# EAGLE design VU (EAGLE 8.1.1)
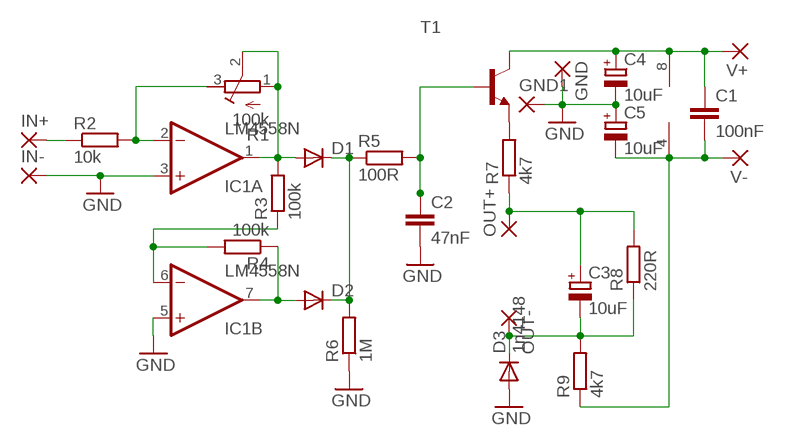
[diagram p0: schematic, sheet 1]

## Parts
C1  100nF  C-EU050-025X075  [C050-025X075]
C2  47nF  C-EU050-025X075  [C050-025X075]
C3  10uF  CPOL-EUE2.5-5  [E2,5-5]
C4  10uF  CPOL-EUE2.5-5  [E2,5-5]
C5  10uF  CPOL-EUE2.5-5  [E2,5-5]
D1  DIODE-D-5  [D-5]
D2  DIODE-D-5  [D-5]
D3  1n4148  DIODE-D-5  [D-5]
GND  WIREPAD1,6/0,8  [1,6/0,8]
GND1  WIREPAD1,6/0,8  [1,6/0,8]
IC1  LM4558N  [DIL08]
IN+  WIREPAD1,6/0,8  [1,6/0,8]
IN-  WIREPAD1,6/0,8  [1,6/0,8]
OUT+  WIREPAD1,6/0,8  [1,6/0,8]
OUT-  WIREPAD1,6/0,8  [1,6/0,8]
R1  100k  R-TRIMM64X  [RTRIM64X]
R2  10k  R-EU_0207/7  [0207/7]
R3  100k  R-EU_0207/7  [0207/7]
R4  100k  R-EU_0207/2V  [0207/2V]
R5  100R  R-EU_0207/7  [0207/7]
R6  1M  R-EU_0207/7  [0207/7]
R7  4k7  R-EU_0207/7  [0207/7]
R8  220R  R-EU_0207/7  [0207/7]
R9  4k7  R-EU_0207/7  [0207/7]
T1  BC546-NPN-TO92-CBE  [TO92-CBE]
V+  WIREPAD1,6/0,8  [1,6/0,8]
V-  WIREPAD1,6/0,8  [1,6/0,8]

## Nets
GND: C2.2 C4.- C5.+ D3.A GND1.1(P) GND.1(P) IC1.3(A:+IN) IC1.5(B:+IN) IN-.1(P) R6.1
N$1: IN+.1(P) R2.1
N$2: IC1.2(A:-IN) R1.3(E) R2.2
N$3: D1.A IC1.1(A:OUT) R1.1(A) R1.2(S) R3.2
N$4: IC1.6(B:-IN) R3.1 R4.2
N$5: D2.A IC1.7(B:OUT) R4.1
N$6: D1.C D2.C R5.1 R6.2
N$7: C2.1 R5.2 T1.B
N$8: R7.2 T1.E
N$9: C3.+ OUT+.1(P) R7.1 R8.2
N$10: C3.- D3.C OUT-.1(P) R8.1 R9.2
N$11: C1.2 C5.- IC1.4(P:V-) R9.1 V-.1(P)
N$13: C1.1 C4.+ IC1.8(P:V+) T1.C V+.1(P)

## Library data of the parts
C1 C2 = rcl:C-EU: CAPACITOR, European symbol
C3-C5 = rcl:CPOL-EU: POLARIZED CAPACITOR, European symbol
D1-D3 = diode:DIODE-: DIODE
GND GND1 IN+ IN- OUT+ OUT- V+ V- = wirepad:WIREPAD: Wire PAD connect wire on PCB
IC1 = linear:*4558: OP AMP
R1 = rcl:R-TRIMM: Trimm resistor
R2-R9 = rcl:R-EU_: RESISTOR, European symbol
T1 = transistor:*-NPN-: NPN Transistror BF959 corrected 2008.03.06

## Board
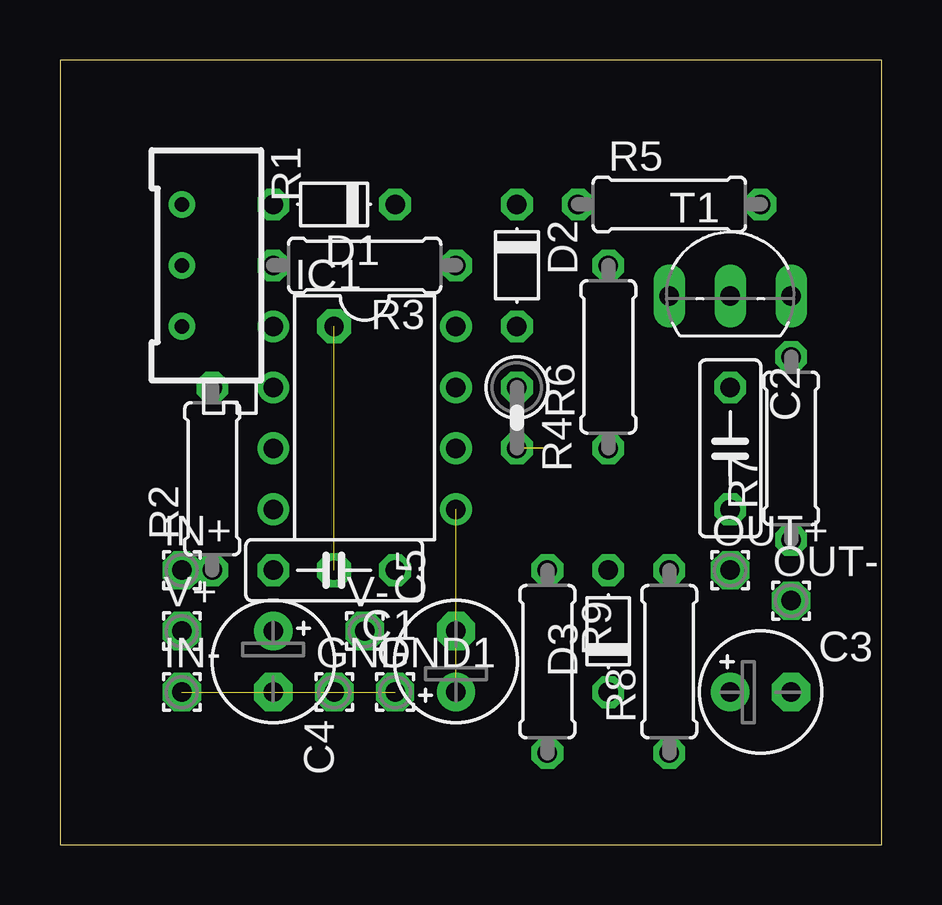
[diagram p1: board, top side]
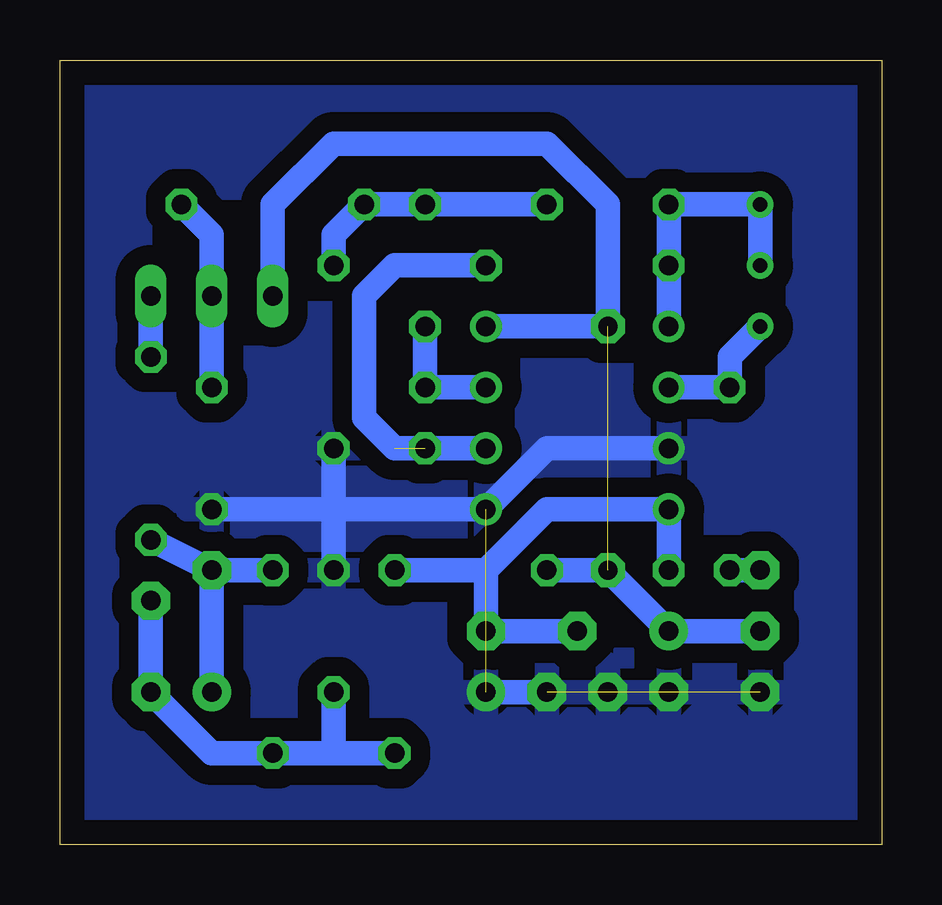
[diagram p2: board, bottom side, seen from below]

Size 34.27 x 32.69 mm. Coordinates in mm from the lower left corner, seen from the top.
Outline: 0,0 34.27,0 34.27,32.69 0,32.69 0,0
Copper layers (1*16): Top 0.035mm / dielectric 1.5mm / Bottom 0.035mm
Design rules "default": minimum track width 10mil, minimum drill 24mil, track to track 8mil, track to pad 8mil, pad to pad 8mil, via to via 8mil, smd to smd 8mil, copper to edge 40mil, drill to drill 8mil, minimum pad ring 10mil, minimum via ring 8mil, stop-mask expansion 4mil, vias tented up to drill 0mil, thermal gap 10mil

### Footprints (pad centres in the part's own frame; a part is rotated, then mirrored left to right if it is on the bottom)
C050-025X075 = drill 0.813 octagon: 1 -2.54,0; 2 2.54,0
E2,5-5 = drill 0.813 pad 1.6: + -1.27,0 | drill 0.813 pad 1.6 octagon: - 1.27,0
D-5 = drill 0.813 octagon: A 2.54,0; C -2.54,0
1,6/0,8 = drill 0.813 pad 1.6 octagon: 1 0,0
DIL08 = drill 0.813 pad 1.27: 1 -3.81,-3.81; 2 -1.27,-3.81; 3 1.27,-3.81; 4 3.81,-3.81; 5 3.81,3.81; 6 1.27,3.81; 7 -1.27,3.81; 8 -3.81,3.81
RTRIM64X = drill 0.61: 1 1.27,-2.54; 2 1.27,0; 3 1.27,2.54
0207/7 = drill 0.813 octagon: 1 -3.81,0; 2 3.81,0
0207/2V = drill 0.813 octagon: 1 -1.27,0; 2 1.27,0
TO92-CBE = drill 0.813 long: B 0,0; C -2.54,0; E 2.54,0

### Placement (x,y rotation side)
C1  11.43,11.43 180 top
C2  27.94,16.51 270 top
C3  29.21,6.35 0 top
C4  8.89,7.62 270 top
C5  16.51,7.62 90 top
D1  11.43,26.67 180 top
D2  19.05,24.13 270 top
D3  22.86,8.89 90 top
GND  11.43,6.35 0 top
GND1  13.97,6.35 0 top
IC1  12.7,17.78 270 top
IN+  5.08,11.43 0 top
IN-  5.08,6.35 0 top
OUT+  27.94,11.43 0 top
OUT-  30.48,10.16 0 top
R1  6.35,24.13 180 top
R2  6.35,15.24 90 top
R3  12.7,24.13 180 top
R4  19.05,17.78 270 top
R5  25.4,26.67 0 top
R6  22.86,20.32 90 top
R7  30.48,16.51 90 top
R8  25.4,7.62 90 top
R9  20.32,7.62 270 top
T1  27.94,22.86 0 top
V+  5.08,8.89 0 top
V-  12.7,8.89 0 top

### Tracks (layer width: path | path; a pad name or v marks a point on that pad's centre or on a via)
GND  (4 unrouted)
  Bottom 1.016: IC1.3 13.97,16.51 IC1.5 | C5.+ GND1.1 | D3.A 22.86,13.97 | 22.86,13.97 IC1.5 | R6.1 22.86,13.97 | 22.86,13.97 C2.2 IC1.5
  pour Bottom (isolate 0.813): 0,33.02 34.29,33.02 34.29,0 0,0
N$1
  Bottom 1.016: IN+.1 R2.1
N$2
  Bottom 1.016: IC1.2 R2.2 6.35,20.32 R1.3
N$3
  Bottom 1.016: IC1.1 R3.2 D1.A R1.1 R1.2
N$4  (1 unrouted)
  Bottom 1.016: R3.1 20.32,24.13 21.59,22.86 21.59,17.78 20.32,16.51 IC1.6
N$5
  Bottom 1.016: IC1.7 R4.1 D2.A
N$6
  Bottom 1.016: D1.C D2.C R5.1 22.86,25.4 R6.2
N$7
  Bottom 1.016: R5.2 27.94,25.4 T1.B C2.1
N$8
  Bottom 1.016: T1.E R7.2
N$9
  Bottom 1.016: R7.1 OUT+.1 | C3.+ OUT+.1 | OUT+.1 R8.2
N$10
  Bottom 1.016: 22.86,3.81 R8.1 27.94,3.81 C3.- OUT-.1 | 22.86,3.81 D3.C | 22.86,3.81 R9.2
N$11
  Bottom 1.016: 16.51,11.43 13.97,13.97 IC1.4 C1.2 | R9.1 16.51,11.43 | 16.51,11.43 C5.- V-.1
N$13  (via drill 0.8 pad 1.42)  (1 unrouted)
  Bottom 1.016: C1.1 v11.43,11.43 C4.+ V+.1 | T1.C 25.4,26.67 22.86,29.21 13.97,29.21 11.43,26.67 v11.43,21.59 IC1.8